# Altium schematic sheet 02_ESP32.SchDoc
size A; SheetNumber: 2; SheetTotal: 3
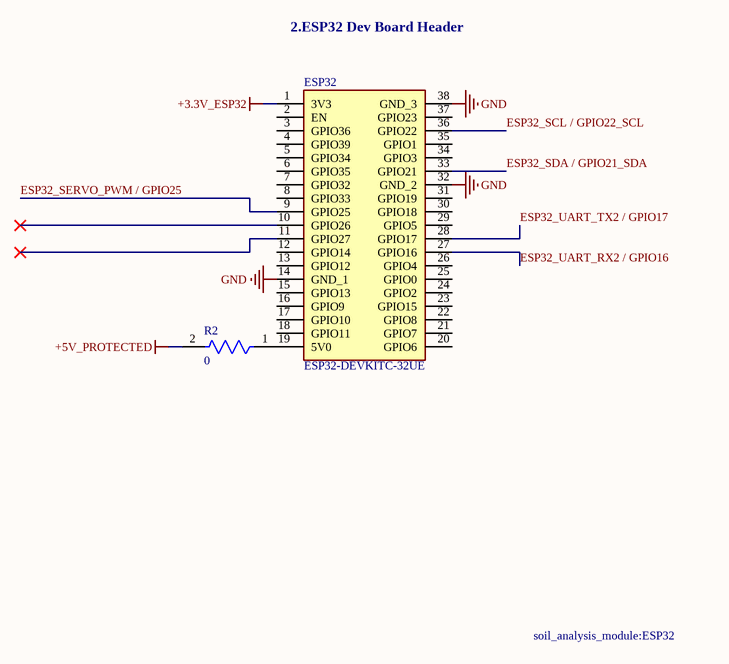
[diagram p0: 02_ESP32.SchDoc]

## Parts
ESP32  ESP32-DEVKITC-32UE  [ESP32-DEVKITC-32UE-Footprint-1]
R2  value 0  [FP-RC1206-MFG]  (hidden comment: RC1206JR-070RL)

## Nets
+3.3V_ESP32: ESP32.1(3V3)
+5V_PROTECTED: R2.2
GND: ESP32.14(GND_1) ESP32.32(GND_2) ESP32.38(GND_3)
ESP32_SCL / GPIO22_SCL: ESP32.36(GPIO22)
ESP32_SDA / GPIO21_SDA: ESP32.33(GPIO21)
ESP32_SERVO_PWM / GPIO25: ESP32.9(GPIO25)
ESP32_UART_RX2 / GPIO16: ESP32.27(GPIO16)
ESP32_UART_TX2 / GPIO17: ESP32.28(GPIO17)
NetESP32_19: ESP32.19(5V0) R2.1

Not connected (* = marked no-connect by the designer): ESP32 2(EN) 3(GPIO36) 4(GPIO39) 5(GPIO34) 6(GPIO35) 7(GPIO32) 8(GPIO33) 10(GPIO26)* 11(GPIO27)* 12(GPIO14) 13(GPIO12) 15(GPIO13) 16(GPIO9) 17(GPIO10) 18(GPIO11) 20(GPIO6) 21(GPIO7) 22(GPIO8) 23(GPIO15) 24(GPIO2) 25(GPIO0) 26(GPIO4) 29(GPIO5) 30(GPIO18) 31(GPIO19) 34(GPIO3) 35(GPIO1) 37(GPIO23)

## Notes on the sheet
- 2.ESP32 Dev Board Header
- soil_analysis_module:ESP32

## Library data of the parts
ESP32 = CMP-020-00024-1: ESP32-WROOM-32UE Series Evaluation Board 802.11 b/g/n (WiFi, WLAN) Bluetooth Smart Ready 4.x Dual Mode
R2 = CMP-009-00183-1: GENERAL PURPOSE CHIP RESISTOR Metal Glaze/thick Film, 0.25W, 0ohm, Surface Mount, 1206; Voltage Rating: 200V; Tolerance: 5%; Max Operating Temperature: 155°C; Pins: 2; Case/Package: 1206; Mounting Technology: Surface Mount; Min Operating Temperature: -55°C